# Altium project PCB_Project.PrjPcb
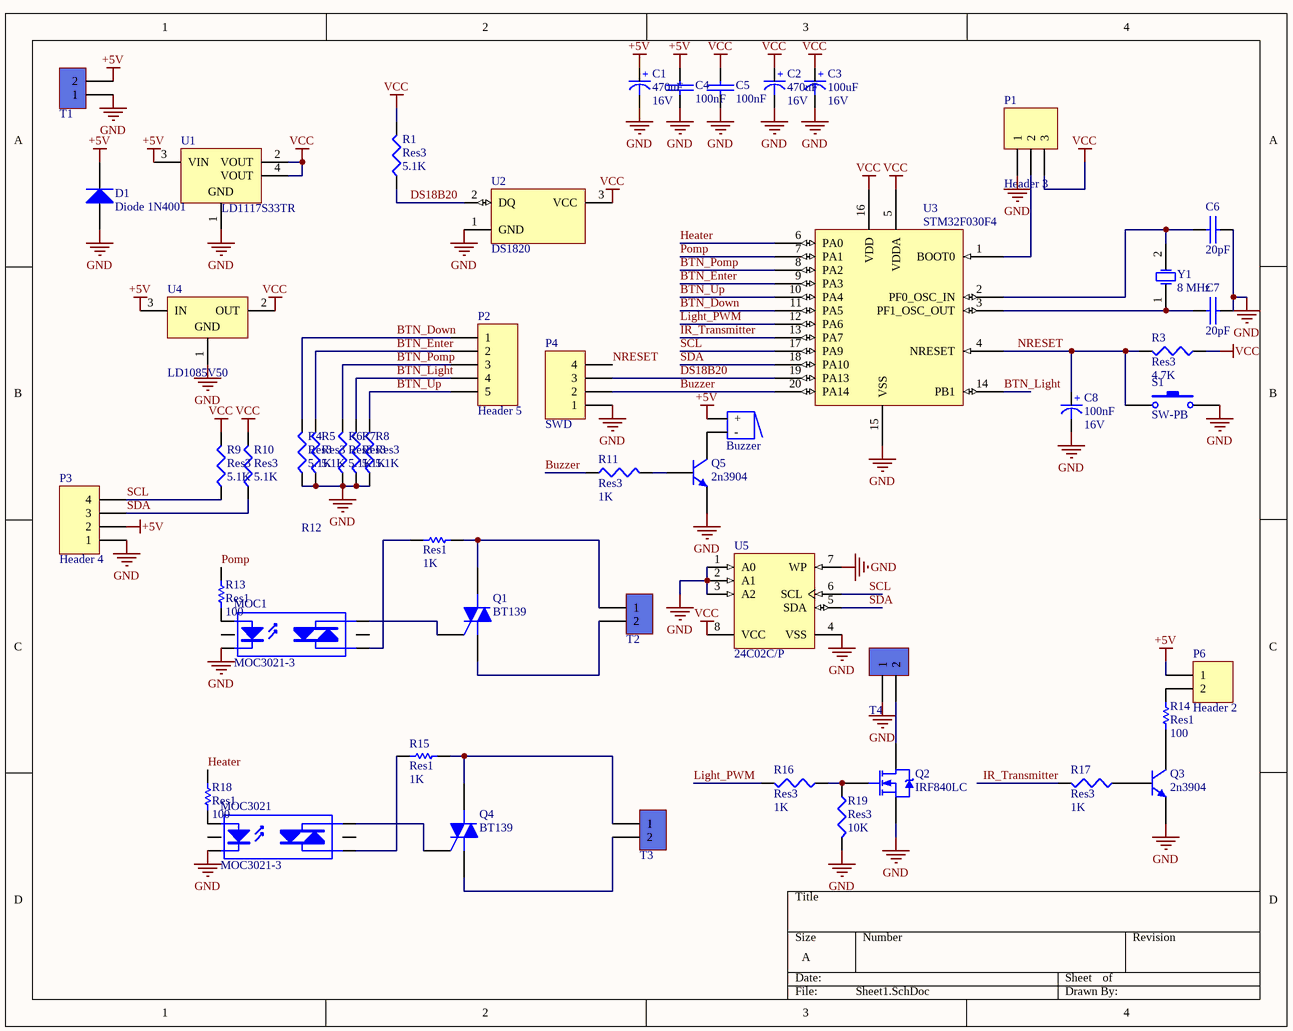
[diagram p0: Sheet1.SchDoc]
1 sheet, 51 parts. Net scope: global (net labels, ports and power ports of the same name join across sheets).
Board file: PCB1.PcbDoc

## Sheet Sheet1.SchDoc
size A

### Parts
Buzzer  Buzzer  [BUZZER]  (value not drawn)
C1  Voltage: 16V  [cap 03]  (hidden comment: 470uF)
C2  Voltage: 16V  [cap 03]  (hidden comment: 470uF)
C3  Voltage: 16V  [cap 02]  (hidden comment: 100uF)
C4  100nF  [SMD_CAP_1206]
C5  100nF  [SMD_CAP_1206]
C6  20pF  [SMD_CAP_0603]
C7  20pF  [SMD_CAP_0603]
C8  Voltage: 16V  [cap 01]  (hidden comment: 100nF)
D1  Diode 1N4001  [DO-41]
MOC1  MOC3021-3  [DIP-6]
MOC3021  MOC3021-3  [DIP-6]
P1  Header 3  [HDR1X3]
P2  Header 5  [HDR1X5]
P3  Header 4  [HDR1X4]
P4  SWD  [HDR1X4]
P6  Header 2  [HDR1X2]
Q1  BT139  [221A-09]
Q2  IRF840LC  [TO-220AB]
Q3  2n3904  [SOT323_L]
Q4  BT139  [221A-09]
Q5  2n3904  [SOT323_L]
R1  Res3  value 5.1K  [J1-0603]
R3  Res3  value 4.7K  [J1-0603]
R4  Res3  value 5.1K  [J1-0603]
R5  Res3  value 5.1K  [J1-0603]
R6  Res3  value 5.1K  [J1-0603]
R7  Res3  value 5.1K  [J1-0603]
R8  Res3  value 5.1K  [J1-0603]
R9  Res3  value 5.1K  [J1-0603]
R10  Res3  value 5.1K  [J1-0603]
R11  Res3  value 1K  [AXIAL-0.3]
R12  Res1  value 1K  [AXIAL-0.3]
R13  Res1  value 100  [AXIAL-0.3]
R14  Res1  value 100  [AXIAL-0.3]
R15  Res1  value 1K  [AXIAL-0.3]
R16  Res3  value 1K  [J1-0603]
R17  Res3  value 1K  [J1-0603]
R18  Res1  value 100  [AXIAL-0.3]
R19  Res3  value 10K  [J1-0603]
S1  SW-PB  [SPST-2]
T1  Terminal  [Terminal 1*2]  (value not drawn)
T2  Terminal  [Terminal 1*2]  (value not drawn)
T3  Terminal  [Terminal 1*2]  (value not drawn)
T4  Terminal  [Terminal 1*2]  (value not drawn)
U1  LD1117S33TR  [SOT-223_N]
U2  DS1820  [HDR1X3]
U3  STM32F030F4  [TSSOP20]
U4  LD1085V50  [TO220]
U5  24C02C/P  [PDIP300-P8]
Y1  8 MHz  [XTAL]

### Nets
+5V: Buzzer.1(+) C1.1(+) C4.1(+) D1.2(K) P3.2 P6.1 T1.2 U1.3(VIN) U4.3(IN)
GND: C1.2(-) C2.2(-) C3.2(-) C4.2(-) C5.2(-) C6.2(-) C7.2(-) C8.2(-) D1.1(A) MOC1.2(K) MOC3021.2(K) P1.1 P3.1 P4.1 Q2.3(S) Q3.2(E) Q5.2(E) R4.1 R5.1 R6.1 R7.1 R8.1 R19.2 S1.2 T1.1 T4.1 U1.1(GND) U2.1(GND) U3.15(VSS) U4.1(GND) U5.1(A0) U5.2(A1) U5.3(A2) U5.4(VSS) U5.7(WP)
VCC: C2.1(+) C3.1(+) C5.1(+) P1.3 R1.2 R3.1 R9.2 R10.2 U1.2(VOUT) U1.4(VOUT) U2.3(VCC) U3.5(VDDA) U3.16(VDD) U4.2(OUT) U5.8(VCC)
BTN_Down: P2.1 R4.2 U3.11(PA5)
BTN_Enter: P2.2 R5.2 U3.9(PA3)
BTN_Light: P2.4 R7.2 U3.14(PB1)
BTN_Pomp: P2.3 R6.2 U3.8(PA2)
BTN_Up: P2.5 R8.2 U3.10(PA4)
Buzzer: P4.2 R11.1 U3.20(PA14)
DS18B20: P4.3 R1.1 U2.2(DQ) U3.19(PA13)
Heater: R18.1 U3.6(PA0)
IR_Transmitter: R17.2 U3.13(PA7)
Light_PWM: R16.2 U3.12(PA6)
NRESET: C8.1(+) P4.4 R3.2 S1.1 U3.4(NRESET)
Pomp: R13.1 U3.7(PA1)
SCL: P3.4 R9.1 U3.17(PA9) U5.6(SCL)
SDA: P3.3 R10.1 U3.18(PA10) U5.5(SDA)
NetBuzzer_2: Buzzer.2(-) Q5.3(C)
NetC6_1: C6.1(+) U3.2(PF0_OSC_IN) Y1.2(OSC2)
NetC7_1: C7.1(+) U3.3(PF1_OSC_OUT) Y1.1(OSC1)
NetMOC1_1: MOC1.1(A) R13.2
NetMOC1_4: MOC1.4(A/K) Q1.3(G)
NetMOC1_6: MOC1.6(A/K) R12.1
NetMOC3021_1: MOC3021.1(A) R18.2
NetMOC3021_4: MOC3021.4(A/K) Q4.3(G)
NetMOC3021_6: MOC3021.6(A/K) R15.1
NetP1_2: P1.2 U3.1(BOOT0)
NetP6_2: P6.2 R14.1
NetQ1_1: Q1.1(M1) T2.2
NetQ1_2: Q1.2(M2) R12.2 T2.1
NetQ2_1: Q2.1(G) R16.1 R19.1
NetQ2_2: Q2.2(D) T4.2
NetQ3_1: Q3.1(B) R17.1
NetQ3_3: Q3.3(C) R14.2
NetQ4_1: Q4.1(M1) T3.2
NetQ4_2: Q4.2(M2) R15.2 T3.1
NetQ5_1: Q5.1(B) R11.2

Not connected (* = marked no-connect by the designer): MOC1 3(NC) 5(NC); MOC3021 3(NC) 5(NC)

### Library data of the parts
Buzzer = Buzzer: Designer: Seyed Mohsen Ghasemain; ComponentLinkURL: www.picpars.com
C1-C3 C8 = Cap-Polar: Polar Capacitor; Designer: Saeid Jorablo; Organazation: ControTec; Adding Date: 1387/12/20
  C1 C2: Value: 470uF
  C3: Value: 100uF
  C8: Value: 100nF
C4-C7 = Cap-Bipolar: Bipolar Capacitor; Voltage: 100V; Designer: Saeid Jorablo; Organazation: ControTec; Adding Date: 1387/12/20
  C4 C5: Value: 100nF
  C6 C7: Value: 20pF
D1 = Diode 1N4001: 1 Amp General Purpose Rectifier; Published: 8-Jun-2000; LatestRevisionDate: 17-Jul-2002; LatestRevisionNote: Re-released for DXP Platform.; DatasheetVersion: 1998; PackageVersion: Aug-1999; PackageReference: DO-41; Publisher: Altium Limited; PackageDescription: Diode, Axial; Body 5.2 x 2.7 mm (LxDia. max), Lead Dia. 0.86 mm (max); Code_JEDEC: DO-204-AL; ComponentLink1Description: Manufacturer Link; ComponentLink1URL: http://www.fairchildsemi.com/; ComponentLink2Description: Datasheet; ComponentLink2URL: http://www.fairchildsemi.com/ds/1N%2F1N4001.pdf
MOC1 MOC3021 = MOC3021-3: Opto-Triac; Designer: Seyed Mohsen Ghasemian; E-mail: picpars@gmail.com; Published: 17-11-2011; LatestRevisionDate: 17-11-2011; Publisher: www.picpars.com; WEB: www.picpars.com
P1 = Header 3: Header, 3-Pin; LatestRevisionDate: 17-Jul-2002; LatestRevisionNote: Re-released for DXP Platform.; Publisher: Altium Limited
P2 = Header 5: Header, 5-Pin; LatestRevisionDate: 17-Jul-2002; LatestRevisionNote: Re-released for DXP Platform.; Publisher: Altium Limited
P3 P4 = Header 4: Header, 4-Pin; LatestRevisionDate: 17-Jul-2002; LatestRevisionNote: Re-released for DXP Platform.; Publisher: Altium Limited
P6 = Header 2: Header, 2-Pin; LatestRevisionDate: 17-Jul-2002; LatestRevisionNote: Re-released for DXP Platform.; Publisher: Altium Limited
Q1 Q4 = MAC15A6: Silicon Bidirectional Triode Thyristor; Note: Pin 2 is electrically connected to Pin 4 (TAB); Published: 29-Sep-2000; LatestRevisionDate: 17-Jul-2002; LatestRevisionNote: Re-released for DXP Platform.; DatasheetVersion: 1999; PackageVersion: 1997; PackageReference: 221A-09; Publisher: Altium Limited; PackageDescription: TO, Thru-Hole, Vertical, Heatsink Mounted; 3 In-Line Leads; Pitch 2.54 mm; Code_JEDEC: TO-262-AA; ComponentLink1Description: Manufacturer Link; ComponentLink1URL: http://www.onsemi.com/site/products/landing?taxonomyID=194; ComponentLink2Description: Datasheet; ComponentLink2URL: http://www.onsemi.com/pub/Collateral/MAC15A4-D.PDF
Q2 = IRF840LC: HEXFET Power MOSFET; Note: Pin 2 is electrically connected to pin 4.; Published: 8-Jun-2000; LatestRevisionDate: 17-Jul-2002; LatestRevisionNote: Re-released for DXP Platform.; DatasheetVersion: PD-9.1069; PackageVersion: Feb-1997; PackageReference: TO-220AB; Publisher: Altium Limited; PackageDescription: TO, Thru-Hole, Vertical, Heatsink Mounted; 3 In-Line Leads; Pitch 2.54 mm; ComponentLink1Description: Manufacturer Link; ComponentLink1URL: http://www.irf.com/; ComponentLink2Description: Datasheet; ComponentLink2URL: http://www.irf.com/product-info/datasheets/data/irf840lc.pdf
Q3 Q5 = PMST2222: NPN Switching Transistor; Published: 17-Sep-2003; LatestRevisionDate: 12-Dec-2006; LatestRevisionNote: IPC-7351 Footprint Added.; DatasheetVersion: 22-Apr-1999; PackageVersion: Apr-1999; PackageReference: SOT323; Publisher: Altium Limited; PackageDescription: 3-Pin SOT-323 Package 0.65 mm Pitch, 2.1 mm Lead Span; ComponentLink1Description: Manufacturer Link; ComponentLink1URL: http://www.semiconductors.philips.com/; ComponentLink2Description: Datasheet; ComponentLink2URL: http://www.semiconductors.philips.com/acrobat/datasheets/PMST2222_2222A_2.pdf
R1 R3-R11 R16 R17 R19 = Res3: Resistor; Published: 8-Jun-2000; LatestRevisionDate: 29-May-2009; LatestRevisionNote: IPC-7351 Footprint Added.; PackageReference: J1-0603; Publisher: Altium Limited; PackageDescription: Chip Resistor
R12-R15 R18 = Res1: Resistor; Published: 8-Jun-2000; LatestRevisionDate: 17-Jul-2002; LatestRevisionNote: Re-released for DXP Platform.; PackageReference: AXIAL-0.3; Publisher: Altium Limited; PackageDescription: Axial Device, Thru-Hole; 2 Leads; 0.3 in Pin Spacing
S1 = SW-PB: Switch; Published: 24-Mar-1999; LatestRevisionDate: 17-Jul-2002; LatestRevisionNote: Re-released for DXP Platform.; PackageReference: SPST-2; Publisher: Altium Limited; PackageDescription: Switch; 2 Leads
T1-T4 = Terminal 1*2: Terminal 2 Pin 250VAC 16A; Designer: Seyed Mohsen Ghasemain; E-mail: picpars@gmail.com; ComponentLinkURL: www.picpars.com
U1 = LD1117S33TR: Fixed Low Drop Positive Voltage Regulator, 3.3V, 4-Pin SOT-223, Tape and Reel; DatasheetVersion: Nov-2011; PackageVersion: 2010; PackageReference: SOT-223; PackageDescription: 4-Pin SOT-223 Package, 6.5 x 3.5 mm Body, 2.3 mm Pitch, 7 mm Lead Span; PartNumber: LD1117S33TR; ComponentLink1Description: Manufacturer URL; ComponentLink1URL: http://www.st.com; ComponentLink2Description: Datasheet; ComponentLink2URL: http://www.st.com/internet/com/TECHNICAL_RESOURCES/TECHNICAL_LITERATURE/DATASHEET/CD00000544.pdf
U2 = DS1820: 1-Wire Digital Thermometer; ComponentAvailability: Obsolete; Published: 13-Oct-2000; LatestRevisionDate: 17-Jul-2002; LatestRevisionNote: Re-released for DXP Platform.; DatasheetVersion: 5-Mar-1998; PackageVersion: 1999; PackageReference: PR35; Publisher: Altium Limited; PackageDescription: TO, Flat Index; 3 In-Line, Axial Leads; Body Dia. 4.6mm; Leads 0.56 x 0.51 mm (max); ComponentLink1Description: Manufacturer Link; ComponentLink1URL: http://www.maxim-ic.com/; ComponentLink2Description: Datasheet; ComponentLink2URL: http://pdfserv.maxim-ic.com/en/ds/DS1820-DS1820S.pdf; ComponentLink3Description: Discontinuation Notice; ComponentLink3URL: http://www.maxim-ic.com/qa/pdfs/non-obsolescence-letter.pdf
U3 = STM32F030F4: STM32 ARM-based 32-bit MCU
U4 = LD1085V50: 3A, Low Drop Positive Voltage Regulator, 5V, 3-Pin TO-220; DatasheetVersion: Jul-2009; PackageVersion: ver3.0; PackageReference: TO220; PackageDescription: TO, Thru-Hole, Vertical, Heatsink Mounted; 3 In-Line Leads; Pitch 2.54 mm; PartNumber: LD1085V50; ComponentLink1Description: Manufacturer URL; ComponentLink1URL: http://www.st.com; ComponentLink2Description: Datasheet; ComponentLink2URL: http://www.st.com/internet/com/TECHNICAL_RESOURCES/TECHNICAL_LITERATURE/DATASHEET/CD00001883.pdf; ComponentLink3Description: Package Specification; ComponentLink3URL: http://www.st.com/internet/com/TECHNICAL_RESOURCES/TECHNICAL_LITERATURE/PACKAGE_INFORMATION/CD00004649.pdf
U5 = 24C02C/P: 2Kbit, 400kHz, 5V, I2C Serial EEPROM, 8-Pin PDIP, Commercial Temperature; Published: 29-Jan-2009; DatasheetVersion: revJ, Aug-2008; PackageVersion: revAW, Oct-2008; PackageReference: PDIP300-P8; Publisher: Altium Limited; PackageDescription: 8-Lead Plastic Dual In-Line (P) - 300 mil Body [PDIP]; Code_JEDEC: MS-001; ComponentLink1Description: Manufacturer Link; ComponentLink1URL: http://www.microchip.com; ComponentLink2Description: Datasheet; ComponentLink2URL: http://ww1.microchip.com/downloads/en/DeviceDoc/21202J.pdf; ComponentLink3Description: Packaging Specification; ComponentLink3URL: http://ww1.microchip.com/downloads/en/PackagingSpec/00049AW.pdf
Y1 = XTAL: XTAL Crystal; Company: E.P.I.L; Design Date: 11/04/2011; Value: 8 MHz